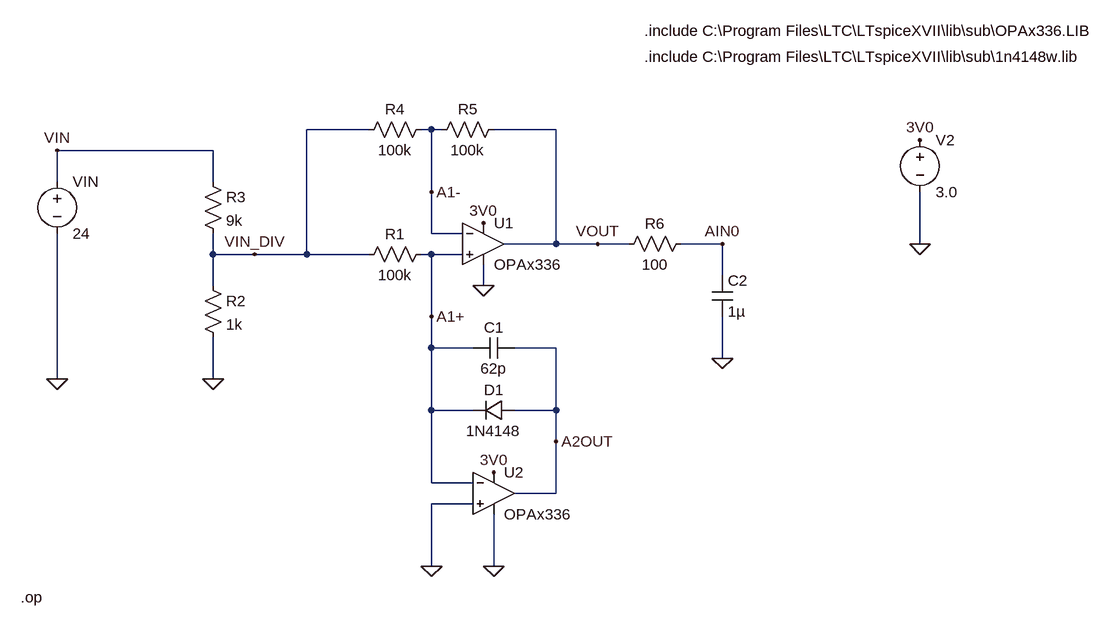
[diagram p0: schematic voltmeter.asc]
voltmeter.asc, the LTspice schematic file:
Version 4
SHEET 1 1212 832
WIRE 16 0 -80 0
WIRE 112 0 96 0
WIRE 128 0 112 0
WIRE 304 0 208 0
WIRE -224 32 -464 32
WIRE -464 80 -464 32
WIRE -224 80 -224 32
WIRE 112 96 112 0
WIRE 112 160 112 96
WIRE 160 160 112 160
WIRE 304 176 304 0
WIRE 304 176 224 176
WIRE 368 176 304 176
WIRE 416 176 368 176
WIRE 560 176 496 176
WIRE 864 176 864 96
WIRE -224 192 -224 160
WIRE -160 192 -224 192
WIRE -80 192 -80 0
WIRE -80 192 -160 192
WIRE 16 192 -80 192
WIRE 112 192 96 192
WIRE 160 192 112 192
WIRE 560 224 560 176
WIRE -224 240 -224 192
WIRE 192 240 192 208
WIRE 112 288 112 192
WIRE 112 336 112 288
WIRE 176 336 112 336
WIRE 304 336 240 336
WIRE 560 352 560 288
WIRE -464 384 -464 160
WIRE -224 384 -224 320
WIRE 112 432 112 336
WIRE 176 432 112 432
WIRE 304 432 304 336
WIRE 304 432 240 432
WIRE 304 480 304 432
WIRE 112 544 112 432
WIRE 176 544 112 544
WIRE 304 560 304 480
WIRE 304 560 240 560
WIRE 176 576 112 576
WIRE 112 672 112 576
WIRE 208 672 208 592
FLAG 560 352 0
FLAG 208 672 0
FLAG 192 240 0
FLAG -224 384 0
FLAG -464 384 0
FLAG -464 32 VIN
FLAG -160 192 VIN_DIV
FLAG 368 176 VOUT
FLAG 560 176 AIN0
FLAG 112 672 0
FLAG 864 16 3V0
FLAG 864 176 0
FLAG 192 144 3V0
FLAG 208 528 3V0
FLAG 112 288 A1+
FLAG 304 480 A2OUT
FLAG 112 96 A1-
SYMBOL OpAmps\\opamp2 192 112 R0
SYMATTR InstName U1
SYMATTR Value OPAx336
SYMBOL OpAmps\\opamp2 208 496 R0
SYMATTR InstName U2
SYMATTR Value OPAx336
SYMBOL res 112 176 R90
WINDOW 0 0 56 VBottom 2
WINDOW 3 32 56 VTop 2
SYMATTR InstName R1
SYMATTR Value 100k
SYMATTR SpiceLine tol=1
SYMBOL res -240 224 R0
SYMATTR InstName R2
SYMATTR Value 1k
SYMATTR SpiceLine tol=0.05 pwr=1m
SYMBOL res -240 64 R0
SYMATTR InstName R3
SYMATTR Value 9k
SYMATTR SpiceLine tol=0.05 pwr=100m
SYMBOL res 112 -16 R90
WINDOW 0 0 56 VBottom 2
WINDOW 3 32 56 VTop 2
SYMATTR InstName R4
SYMATTR Value 100k
SYMATTR SpiceLine tol=0.05 pwr=1m
SYMBOL res 224 -16 R90
WINDOW 0 0 56 VBottom 2
WINDOW 3 32 56 VTop 2
SYMATTR InstName R5
SYMATTR Value 100k
SYMATTR SpiceLine tol=0.05 pwr=1m
SYMBOL res 512 160 R90
WINDOW 0 0 56 VBottom 2
WINDOW 3 32 56 VTop 2
SYMATTR InstName R6
SYMATTR Value 100
SYMBOL diode 240 416 R90
WINDOW 0 0 32 VBottom 2
WINDOW 3 32 32 VTop 2
SYMATTR InstName D1
SYMATTR Value 1N4148
SYMBOL cap 240 320 R90
WINDOW 0 0 32 VBottom 2
WINDOW 3 32 32 VTop 2
SYMATTR InstName C1
SYMATTR Value 62p
SYMBOL cap 544 224 R0
SYMATTR InstName C2
SYMATTR Value 1µ
SYMBOL voltage -464 64 R0
WINDOW 123 0 0 Left 0
WINDOW 39 0 0 Left 0
SYMATTR InstName VIN
SYMATTR Value 24
SYMBOL voltage 864 0 R0
WINDOW 123 0 0 Left 0
WINDOW 39 0 0 Left 0
SYMATTR InstName V2
SYMATTR Value 3.0
TEXT 440 -152 Left 2 !.include C:\\Program Files\\LTC\\LTspiceXVII\\lib\\sub\\OPAx336.LIB
TEXT 440 -112 Left 2 !.include C:\\Program Files\\LTC\\LTspiceXVII\\lib\\sub\\1n4148w.lib
TEXT -520 720 Left 2 !.op

The netlist it stands for:
* voltmeter.asc
XU1 A1+ A1- 3V0 0 VOUT OPAx336  ; pins In+ In- V+ V- OUT
XU2 0 A1+ 3V0 0 A2OUT OPAx336  ; pins In+ In- V+ V- OUT
R1 A1+ VIN_DIV 100k tol=1
R2 VIN_DIV 0 1k tol=0.05 pwr=1m
R3 VIN VIN_DIV 9k tol=0.05 pwr=100m
R4 A1- VIN_DIV 100k tol=0.05 pwr=1m
R5 VOUT A1- 100k tol=0.05 pwr=1m
R6 AIN0 VOUT 100
D1 A2OUT A1+ 1N4148
C1 A2OUT A1+ 62p
C2 AIN0 0 1µ
VIN VIN 0 24
V2 3V0 0 3.0
.model D D
.lib standard.dio
.include C:\Program Files\LTC\LTspiceXVII\lib\sub\OPAx336.LIB
.include C:\Program Files\LTC\LTspiceXVII\lib\sub\1n4148w.lib
.op
.backanno
.end